# Altium schematic sheet 19_FPGA_misc.SchDoc: FPGA misc (PCIe, config)
size A3; Organization: Lime Microsystems; Address1: Surrey Tech Centre; Address2: Guildford GU2 7YG; Address3: Surrey; Address4: United Kingdom; Revision: v1.1; SheetNumber: 19; SheetTotal: 31
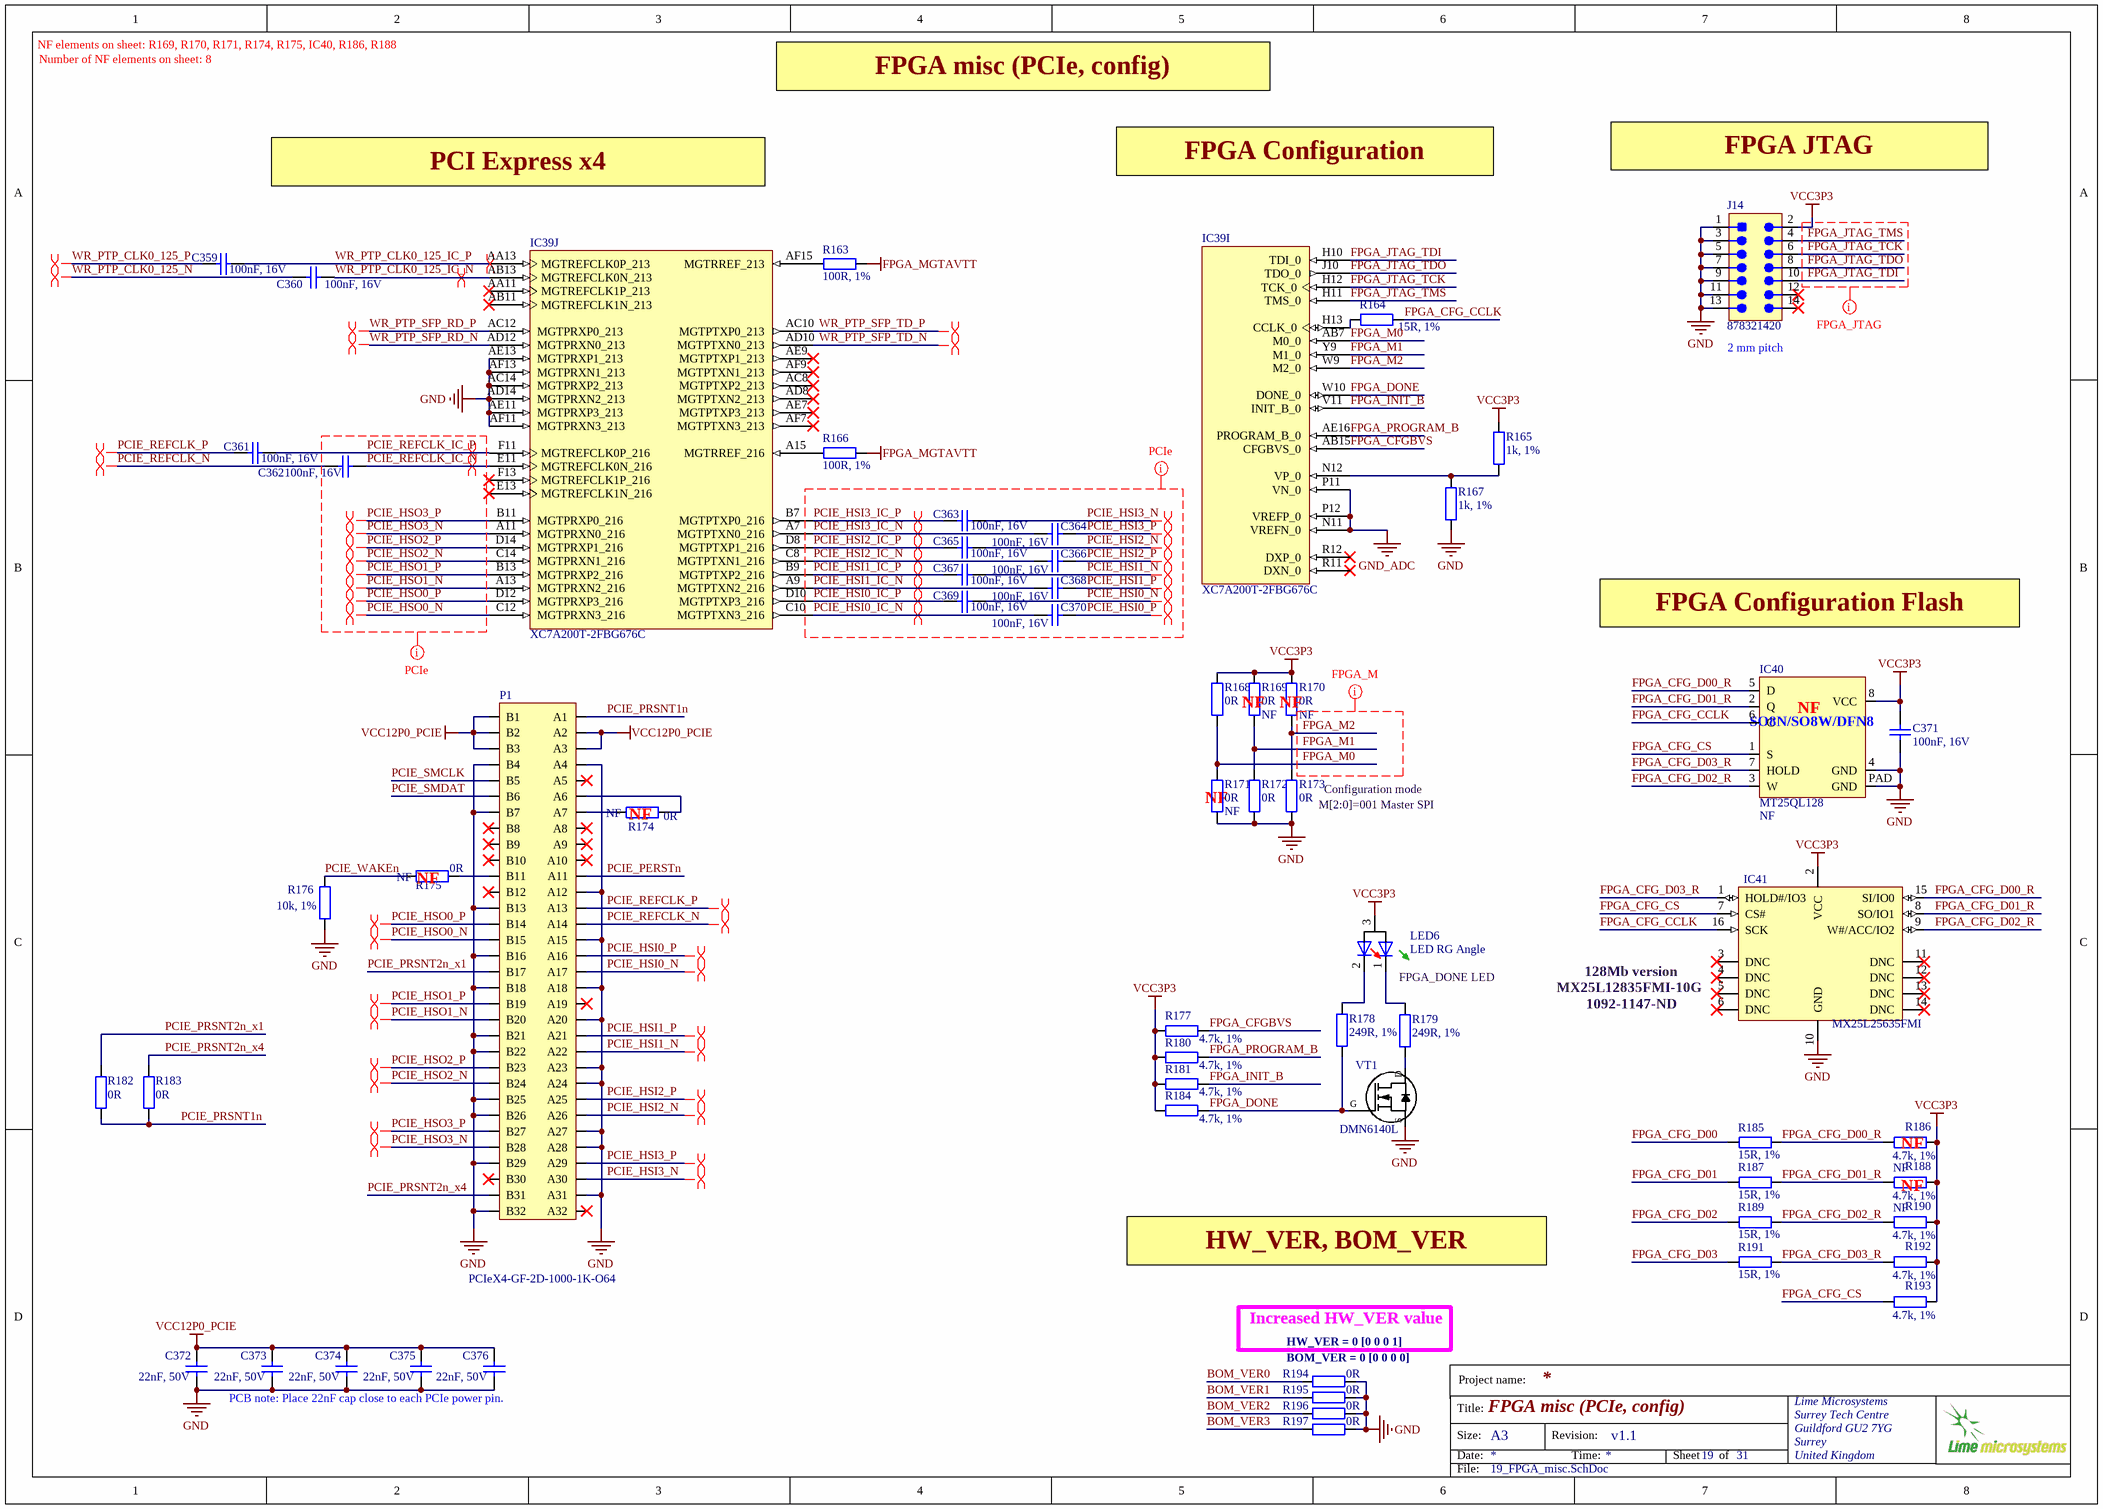
[diagram p0: 19_FPGA_misc.SchDoc]

## Parts
C359  100nF, 16V  [CAP0402]
C360  100nF, 16V  [CAP0402]
C361  100nF, 16V  [CAP0402]
C362  100nF, 16V  [CAP0402]
C363  100nF, 16V  [CAP0402]
C364  100nF, 16V  [CAP0402]
C365  100nF, 16V  [CAP0402]
C366  100nF, 16V  [CAP0402]
C367  100nF, 16V  [CAP0402]
C368  100nF, 16V  [CAP0402]
C369  100nF, 16V  [CAP0402]
C370  100nF, 16V  [CAP0402]
C371  100nF, 16V  [CAP0402]
C372  22nF, 50V  [CAP0402]
C373  22nF, 50V  [CAP0402]
C374  22nF, 50V  [CAP0402]
C375  22nF, 50V  [CAP0402]
C376  22nF, 50V  [CAP0402]
IC39  XC7A200T-2FBG676C  [XC7A200T-2FBG676C_FBG676]  (parts I,J of 14)
IC40  MT25QL128  Assembly Info: NF  [S25FL164K_WSON8_DFN6]
IC41  MX25L25635FMI  [SOIC16_WIDE]
J14  878321420  [MOLEX-878321420_V]
LED6  LED RG Angle  [LED_RG_RIGHT_ANGLE_v3]
P1  PCIeX4-GF-2D-1000-1K-O64  [PCIeX4-GF-2D-1000-1K-O64]  (no BOM)
R163  100R, 1%  [RES0402]
R164  15R, 1%  [RES0402]
R165  1k, 1%  [RES0402]
R166  100R, 1%  [RES0402]
R167  1k, 1%  [RES0402]
R168  0R  [RES0402]
R169  0R  Assembly Info: NF  [RES0402]
R170  0R  Assembly Info: NF  [RES0402]
R171  0R  Assembly Info: NF  [RES0402]
R172  0R  [RES0402]
R173  0R  [RES0402]
R174  0R  Assembly Info: NF  [RES0402]
R175  0R  Assembly Info: NF  [RES0402]
R176  10k, 1%  [RES0402]
R177  4.7k, 1%  [RES0402]
R178  249R, 1%  [RES0402]
R179  249R, 1%  [RES0402]
R180  4.7k, 1%  [RES0402]
R181  4.7k, 1%  [RES0402]
R182  0R  [RES0402]
R183  0R  [RES0402]
R184  4.7k, 1%  [RES0402]
R185  15R, 1%  [RES0402]
R186  4.7k, 1%  Assembly Info: NF  [RES0402]
R187  15R, 1%  [RES0402]
R188  4.7k, 1%  Assembly Info: NF  [RES0402]
R189  15R, 1%  [RES0402]
R190  4.7k, 1%  [RES0402]
R191  15R, 1%  [RES0402]
R192  4.7k, 1%  [RES0402]
R193  4.7k, 1%  [RES0402]
R194  0R  [RES0402]
R195  0R  [RES0402]
R196  0R  [RES0402]
R197  0R  [RES0402]
VT1  DMN6140L  [SOT23-3]

## Nets
FPGA_MGTAVTT: R163.2 R166.2
GND: C371.2 C372.2 C373.2 C374.2 C375.2 C376.2 IC39.AC14(MGTPRXP2_213) IC39.AD14(MGTPRXN2_213) IC39.AE11(MGTPRXP3_213) IC39.AE13(MGTPRXP1_213) IC39.AF11(MGTPRXN3_213) IC39.AF13(MGTPRXN1_213) IC40.4(GND) IC40.PAD(GND) IC41.10(GND) J14.1 J14.3 J14.5 J14.7 J14.9 J14.11 J14.13 P1.A4 P1.A12 P1.A15 P1.A18 P1.A20 P1.A23 P1.A24 P1.A27 P1.A28 P1.A31 P1.B4 P1.B7 P1.B13 P1.B16 P1.B18 P1.B21 P1.B22 P1.B25 P1.B26 P1.B29 P1.B32 R167.1 R171.2 R172.2 R173.2 R176.2 R194.2 R195.2 R196.2 R197.2 VT1.S
GND_ADC: IC39.N11(VREFN_0) IC39.P11(VN_0) IC39.P12(VREFP_0)
VCC3P3: C371.1 IC40.8(VCC) IC41.2(VCC) J14.2 LED6.3(A) R165.1 R168.1 R169.1 R170.1 R177.1 R180.1 R181.1 R184.1 R186.1 R188.1 R190.1 R192.1 R193.1
VCC12P0_PCIE: C372.1 C373.1 C374.1 C375.1 C376.1 P1.A2 P1.A3 P1.B1 P1.B2 P1.B3
BOM_VER0: R194.1
BOM_VER1: R195.1
BOM_VER2: R196.1
BOM_VER3: R197.1
FPGA_CFG_CCLK: IC40.6(C) IC41.16(SCK) R164.2
FPGA_CFG_CS: IC40.1(S) IC41.7(CS#) R193.2
FPGA_CFG_D00: R185.2
FPGA_CFG_D00_R: IC40.5(D) IC41.15(SI/IO0) R185.1 R186.2
FPGA_CFG_D01: R187.2
FPGA_CFG_D01_R: IC40.2(Q) IC41.8(SO/IO1) R187.1 R188.2
FPGA_CFG_D02: R189.2
FPGA_CFG_D02_R: IC40.3(W) IC41.9(W#/ACC/IO2) R189.1 R190.2
FPGA_CFG_D03: R191.2
FPGA_CFG_D03_R: IC40.7(HOLD) IC41.1(HOLD#/IO3) R191.1 R192.2
FPGA_CFGBVS: IC39.AB15(CFGBVS_0) R177.2
FPGA_DONE: IC39.W10(DONE_0) R178.1 R184.2 VT1.G
FPGA_INIT_B: IC39.V11(INIT_B_0) R181.2
FPGA_JTAG_TCK: IC39.H12(TCK_0) J14.6
FPGA_JTAG_TDI: IC39.H10(TDI_0) J14.10
FPGA_JTAG_TDO: IC39.J10(TDO_0) J14.8
FPGA_JTAG_TMS: IC39.H11(TMS_0) J14.4
FPGA_M0: IC39.AB7(M0_0) R168.2 R171.1
FPGA_M1: IC39.Y9(M1_0) R169.2 R172.1
FPGA_M2: IC39.W9(M2_0) R170.2 R173.1
FPGA_PROGRAM_B: IC39.AE16(PROGRAM_B_0) R180.2
PCIE_HSI0_IC_N: C370.2 IC39.C10(MGTPTXN3_216)
PCIE_HSI0_IC_P: C369.2 IC39.D10(MGTPTXP3_216)
PCIE_HSI0_N: C369.1 P1.A17
PCIE_HSI0_P: C370.1 P1.A16
PCIE_HSI1_IC_N: C368.2 IC39.A9(MGTPTXN2_216)
PCIE_HSI1_IC_P: C367.2 IC39.B9(MGTPTXP2_216)
PCIE_HSI1_N: C367.1 P1.A22
PCIE_HSI1_P: C368.1 P1.A21
PCIE_HSI2_IC_N: C366.2 IC39.C8(MGTPTXN1_216)
PCIE_HSI2_IC_P: C365.2 IC39.D8(MGTPTXP1_216)
PCIE_HSI2_N: C365.1 P1.A26
PCIE_HSI2_P: C366.1 P1.A25
PCIE_HSI3_IC_N: C364.2 IC39.A7(MGTPTXN0_216)
PCIE_HSI3_IC_P: C363.2 IC39.B7(MGTPTXP0_216)
PCIE_HSI3_N: C363.1 P1.A30
PCIE_HSI3_P: C364.1 P1.A29
PCIE_HSO0_N: IC39.C12(MGTPRXN3_216) P1.B15
PCIE_HSO0_P: IC39.D12(MGTPRXP3_216) P1.B14
PCIE_HSO1_N: IC39.A13(MGTPRXN2_216) P1.B20
PCIE_HSO1_P: IC39.B13(MGTPRXP2_216) P1.B19
PCIE_HSO2_N: IC39.C14(MGTPRXN1_216) P1.B24
PCIE_HSO2_P: IC39.D14(MGTPRXP1_216) P1.B23
PCIE_HSO3_N: IC39.A11(MGTPRXN0_216) P1.B28
PCIE_HSO3_P: IC39.B11(MGTPRXP0_216) P1.B27
PCIE_PERSTn: P1.A11
PCIE_PRSNT1n: P1.A1 R182.1 R183.1
PCIE_PRSNT2n_x1: P1.B17 R182.2
PCIE_PRSNT2n_x4: P1.B31 R183.2
PCIE_REFCLK_IC_N: C362.1 IC39.E11(MGTREFCLK0N_216)
PCIE_REFCLK_IC_P: C361.1 IC39.F11(MGTREFCLK0P_216)
PCIE_REFCLK_N: C362.2 P1.A14
PCIE_REFCLK_P: C361.2 P1.A13
PCIE_SMCLK: P1.B5
PCIE_SMDAT: P1.B6
PCIE_WAKEn: R175.1 R176.1
WR_PTP_CLK0_125_IC_N: C360.1 IC39.AB13(MGTREFCLK0N_213)
WR_PTP_CLK0_125_IC_P: C359.1 IC39.AA13(MGTREFCLK0P_213)
WR_PTP_CLK0_125_N: C360.2
WR_PTP_CLK0_125_P: C359.2
WR_PTP_SFP_RD_N: IC39.AD12(MGTPRXN0_213)
WR_PTP_SFP_RD_P: IC39.AC12(MGTPRXP0_213)
WR_PTP_SFP_TD_N: IC39.AD10(MGTPTXN0_213)
WR_PTP_SFP_TD_P: IC39.AC10(MGTPTXP0_213)
NetIC39_A15: IC39.A15(MGTRREF_216) R166.1
NetIC39_AF15: IC39.AF15(MGTRREF_213) R163.1
NetIC39_H13: IC39.H13(CCLK_0) R164.1
NetIC39_N12: IC39.N12(VP_0) R165.2 R167.2
NetLED6_1: LED6.1(C1) R179.2
NetLED6_2: LED6.2(C2) R178.2
NetP1_A6: P1.A6 R174.2
NetP1_A7: P1.A7 R174.1
NetP1_B11: P1.B11 R175.2
NetR179_1: R179.1 VT1.D

Not connected (* = marked no-connect by the designer): IC39 AA11(MGTREFCLK1P_213)* AB11(MGTREFCLK1N_213)* AC8(MGTPTXP2_213)* AD8(MGTPTXN2_213)* AE7(MGTPTXP3_213)* AE9(MGTPTXP1_213)* AF7(MGTPTXN3_213)* AF9(MGTPTXN1_213)* E13(MGTREFCLK1N_216)* F13(MGTREFCLK1P_216)* R11(DXN_0)* R12(DXP_0)*; IC41 3(DNC)* 4(DNC)* 5(DNC)* 6(DNC)* 11(DNC)* 12(DNC)* 13(DNC)* 14(DNC)*; J14 12* 14*; P1 A5* A8* A9* A10* A19* A32* B8* B9* B10* B12* B30*

## Layout directives
differential pair: PCIE_HSI0_IC_N, PCIE_HSI0_IC_P, PCIE_HSI0_N, PCIE_HSI0_P, PCIE_HSI1_IC_N, PCIE_HSI1_IC_P, PCIE_HSI1_N, PCIE_HSI1_P, PCIE_HSI2_IC_N, PCIE_HSI2_IC_P, PCIE_HSI2_N, PCIE_HSI2_P, PCIE_HSI3_IC_N, PCIE_HSI3_IC_P, PCIE_HSI3_N, PCIE_HSI3_P, PCIE_HSO0_N, PCIE_HSO0_P, PCIE_HSO1_N, PCIE_HSO1_P, PCIE_HSO2_N, PCIE_HSO2_P, PCIE_HSO3_N, PCIE_HSO3_P, PCIE_REFCLK_IC_N, PCIE_REFCLK_IC_P, PCIE_REFCLK_N, PCIE_REFCLK_P, WR_PTP_CLK0_125_IC_N, WR_PTP_CLK0_125_IC_P, WR_PTP_CLK0_125_N, WR_PTP_CLK0_125_P, WR_PTP_SFP_RD_N, WR_PTP_SFP_RD_P, WR_PTP_SFP_TD_N, WR_PTP_SFP_TD_P
net class FPGA_JTAG: FPGA_JTAG_TCK, FPGA_JTAG_TDI, FPGA_JTAG_TDO, FPGA_JTAG_TMS
net class FPGA_M: FPGA_M0, FPGA_M1, FPGA_M2
net class PCIe: PCIE_HSI0_IC_N, PCIE_HSI0_IC_P, PCIE_HSI0_N, PCIE_HSI0_P, PCIE_HSI1_IC_N, PCIE_HSI1_IC_P, PCIE_HSI1_N, PCIE_HSI1_P, PCIE_HSI2_IC_N, PCIE_HSI2_IC_P, PCIE_HSI2_N, PCIE_HSI2_P, PCIE_HSI3_IC_N, PCIE_HSI3_IC_P, PCIE_HSI3_N, PCIE_HSI3_P, PCIE_HSO0_N, PCIE_HSO0_P, PCIE_HSO1_N, PCIE_HSO1_P, PCIE_HSO2_N, PCIE_HSO2_P, PCIE_HSO3_N, PCIE_HSO3_P, PCIE_REFCLK_IC_N, PCIE_REFCLK_IC_P

## Notes on the sheet
- NF elements on sheet: R169, R170, R171, R174, R175, IC40, R186, R188
- Number of NF elements on sheet: 8
- FPGA misc (PCIe, config)
- PCI Express x4
- FPGA Configuration
- FPGA JTAG
- (near J14) 2 mm pitch
- FPGA Configuration Flash
- (near R169) NF
- (near R170) NF
- (near IC40) NF
- (near R174) NF
- (near R171) NF
- (near R173) M[2:0]=001 Master SPI
- (near R173) Configuration mode
- (near R175) NF
- FPGA_DONE LED
- (near IC41) 128Mb version
  MX25L12835FMI-10G
  1092-1147-ND
- (near R186) NF
- (near R188) NF
- HW_VER, BOM_VER
- Increased HW_VER value
- (near R194) BOM_VER = 0 [0 0 0 0]
- HW_VER = 0 [0 0 0 1]
- PCB note: Place 22nF cap close to each PCIe power pin.
- Project name:
- Title:
- Size:
- Date:
- A3
- Revision:
- Time:
- Sheet
- of
- File:
- (in symbol M25P40_with_pad) SO8N/SO8W/DFN8

## Library data of the parts
C359-C370 = Cap_0603: Part Description: 0.10µF ±10% 16V X7R Ceramic Capacitor -55°C ~ 125°C Surface Mount, MLCC 0402 (1005 Metric) 0.039" L x 0.020" W (1.00mm x 0.50mm); Manufacturer Part Number 1: GRM155R71C104KA88D; Brand: Murata Electronics; Tolerance: 10 %; Type: General Purpose MLCC; Capacitance: 0.1 uF; Temperature Coefficient / Code: +/- 15 %; Case Height: 0.5 mm; Case Length: 1 mm; Dielectric: X7R; Supplier 1: Mouser; Supplier Part Number 1: 81-GRM155R71C104KA88; Case Code - in: 0402; Manufacturer: Murata Electronics; Category: Multilayer Ceramic Capacitors MLCC - SMD/SMT; Voltage Rating DC: 16 V; Value: 100nF, 16V; Case Code - mm: 1005; Case Width: 0.5 mm; Maximum Operating Temperature: + 125 C; Minimum Operating Temperature: - 55 C; Minimum Order Quantity: 1; Operating Temperature Range: - 55 C to + 125 C; Package / Case: 0402 (1005 metric); Packaging: Reel; Product: General Type MLCCs; Product Category: Low & Medium Capacitance SMD Ceramic Chip Capacitors; Reeling: True; RoHS - Mouser: Y; RoHS: RoHS Compliant; Series: GRM; Standard Pack Qty: 10000; Termination Style: SMD/SMT
C371 = Cap_0603: Manufacturer Part Number 1: GRM155R71C104KA88D; Part Description: 0.10µF ±10% 16V X7R Ceramic Capacitor -55°C ~ 125°C Surface Mount, MLCC 0402 (1005 Metric) 0.039" L x 0.020" W (1.00mm x 0.50mm); Brand: Murata Electronics; Tolerance: 10 %; Type: General Purpose MLCC; Capacitance: 0.1 uF; Temperature Coefficient / Code: +/- 15 %; Case Height: 0.5 mm; Case Length: 1 mm; Dielectric: X7R; Supplier 1: Mouser; Supplier Part Number 1: 81-GRM155R71C104KA88; Case Code - in: 0402; Manufacturer: Murata Electronics; Category: Multilayer Ceramic Capacitors MLCC - SMD/SMT; Voltage Rating DC: 16 V; Value: 100nF, 16V; Case Code - mm: 1005; Case Width: 0.5 mm; Maximum Operating Temperature: + 125 C; Minimum Operating Temperature: - 55 C; Minimum Order Quantity: 1; Operating Temperature Range: - 55 C to + 125 C; Package / Case: 0402 (1005 metric); Packaging: Reel; Product: General Type MLCCs; Product Category: Low & Medium Capacitance SMD Ceramic Chip Capacitors; Reeling: True; RoHS - Mouser: Y; RoHS: RoHS Compliant; Series: GRM; Standard Pack Qty: 10000; Termination Style: SMD/SMT
C372-C376 = Cap_0402: Manufacturer: Kemet; Manufacturer Part Number 1: C0402C223K5RACTU; Part Description: 0.022µF ±10% 50V Ceramic Capacitor X7R 0402 (1005 Metric); Temperature Coefficient: X7R; Tolerance: ±10%; Capacitance: 0.022µF; Value: 22nF, 50V; Supplier 1: Digi-Key; Supplier Part Number 1: 399-7780-1-ND; Ratings: -; Packaging: Cut Tape (CT); Category: Capacitors; Size / Dimension: 0.039" L x 0.020" W (1.00mm x 0.50mm); RoHS: RoHS Compliant; Operating Temperature: -55°C ~ 125°C; Mounting Type: Surface Mount, MLCC; Applications: General Purpose; Voltage - Rated: 50V; Thickness (Max): 0.022" (0.55mm); Features: -; Height - Seated (Max): -; Lead Style: -; Package / Case: 0402 (1005 Metric); Lead Spacing: -
IC39 = XC7A200T-2FBG676C: Artix-7 FPGA, 400 User I/Os, 8 GTP, 676-Ball BGA, Speed Grade 2, Commercial Grade, Pb-Free; Manufacturer: Xilinx; Part Description: IC FPGA 400 I/O 676FCBGA; Speed Grade: -2; Number of Logic Blocks (LABs): 16825; Number of Logic Elements/Cells: 215360; RAM Size: 13455360b; Number of I/Os: 400; Number of Registers: 269200; Memory Type: DDR3; Memory Size: 1GB; Max Supply Voltage: 1.05V; Min Supply Voltage: 950mV; ComponentLink1Description: Manufacturer URL; ComponentLink1URL: http://www.xilinx.com/; ComponentLink2Description: Datasheet; ComponentLink2URL: http://www.xilinx.com/support/documentation/data_sheets/ds180_7Series_Overview.pdf; ComponentLink3Description: Package Specification; ComponentLink3URL: http://www.xilinx.com/support/documentation/user_guides/ug475_7Series_Pkg_Pinout.pdf; ComponentLink4Description: DC and Switching Characteristics; ComponentLink4URL: http://www.xilinx.com/support/documentation/data_sheets/ds181_Artix_7_Data_Sheet.pdf; ComponentLink5Description: Package File; ComponentLink5URL: http://www.xilinx.com/support/packagefiles/a7packages/xc7a200tfbg676pkg.txt; ComponentLink6Description: Packaging and Pinout; ComponentLink6URL: http://www.xilinx.com/support/documentation/user_guides/ug475_7Series_Pkg_Pinout.pdf; Supplier 1: Digi-Key; Supplier Part Number 1: 122-1865-ND; Manufacturer Part Number 1: XC7A200T-2FBG676C; Stock 1: 124; Pricing 1: 1=261,30000 (USD); RoHS: Yes; Case/Package: FCBGA; Number of Pins: 676; Contact Plating: Copper,Tin,Silver; Min Operating Temperature: 0°C; Max Operating Temperature: 85°C; ComponentLink7URL: https://datasheet.ciiva.com/15066/ds181-artix-7-data-sheet-15066344.pdf?src-supplier=Digi-Key; ComponentLink7Description: https://datasheet.ciiva.com/15066/ds181-artix-7-data-sheet-15066344.pdf?src-supplier=Digi-Key; ComponentLink8URL: https://datasheet.ciiva.com/48475/ds180-7series-overview-48475947.pdf?src-supplier=Avnet; ComponentLink8Description: https://datasheet.ciiva.com/48475/ds180-7series-overview-48475947.pdf?src-supplier=Avnet
IC40 = M25P40_with_pad: Manufacturer: Micron Technology; Manufacturer Part Number 1: MT25QL128ABA1ESE-0SITTR; Part Description: FLASH - NOR Memory IC 128Mb (16M x 8) SPI 133MHz  8-SO; Frequency: 133MHz; Memory Size: 128Mb; Memory Type: Non-Volatile,FLASH; Case/Package: SOIC; Max Operating Temperature: 85°C; Min Operating Temperature: -40°C; Mount: Surface Mount; Number of Pins: 8; Packaging: Tape and Reel; Pricing 1: 1=2.67, 10=2.401, 25=2.3632, 50=2.357, 100=2.1061, 250=2.03764, 500=2.03006 (USD); Stock 1: 4313; Supplier 1: Digi-Key; Supplier Part Number 1: 557-1772-1-ND; Value: MT25QL128
IC41 = S25FL032P: Manufacturer: Macronix; Manufacturer Part Number 1: MX25L25635FMI-10G; Part Description: FLASH - NOR Memory IC 256Mb (32M x 8) SPI 104MHz  16-SOP; Operating Supply Voltage: 3.6V; Interface: SPI,Serial; Memory Type: FLASH,NOR; Frequency: 104MHz; Density: 256Mb; Supplier 1: Digi-Key; Supplier Part Number 1: 1092-1149-ND; Stock 1: 19945; Pricing 1: 1=4.09, 528=3.11068 (USD); Case/Package: SOIC; Number of Pins: 16; Min Operating Temperature: -40°C; Max Operating Temperature: 85°C; Package Quantity: 44; Packaging: Rail/Tube; Max Frequency: 104MHz; Lead Free: Lead Free; Value: MX25L25635FMI
J14 = MOLEX_CONNECTOR_0878321420: Male Header, Pitch 2 mm, 2 x 7 Position, Height 7.6 mm, -55 to 105 degC, RoHS; Part Description: Connector Header Surface Mount 14 position 0.079" (2.00mm); Manufacturer: Molex; Manufacturer Part Number 1: 87832-1420; Number of Positions: 14; Current Rating: 2A; Insulation Resistance: 1GR; Voltage Rating: 125V; Shrouded: Yes (With); Pitch: 2mm; Glow Wire Compliant: Non-compliant; Supplier 1: Digi-Key; Stock 1: 62479; Pricing 1: 1 = 1,83000, 10 = 1,66000, 100 = 1,42280, 500 = 1,18562, 3200 = 0,94850, 6400 = 0,90108 (USD); RoHS: Yes; Mount: Surface Mount; Color: Black; Housing Color: Black; Housing Material: Thermoplastic; Contact Plating: Gold; Contact Material: Brass; Min Operating Temperature: -55°C; Max Operating Temperature: 105°C; Number of Rows: 2; Packaging: Rail/Tube; Termination: SMD/SMT; Number of Contacts: 14; Orientation: Vertical; Gender: Male; Package Quantity: 3200; Number of Circuits: 14; Voltage Rating (DC): 125V; Radiation Hardening: No; REACH SVHC: No SVHC; Lead Free: Lead Free; Flammability Rating: UL94 V-0; ComponentLink1URL: https://datasheet.ciiva.com/5151/0878321420-pcb-headers-176595-5151942.pdf?src-supplier=Mouser; ComponentLink1Description: https://datasheet.ciiva.com/5151/0878321420-pcb-headers-176595-5151942.pdf?src-supplier=Mouser; ComponentLink2URL: https://datasheet.ciiva.com/30118/0878321420-pcb-headers-30118102.pdf?src-supplier=Onlinecomponents.com; ComponentLink2Description: https://datasheet.ciiva.com/30118/0878321420-pcb-headers-30118102.pdf?src-supplier=Onlinecomponents.com; ComponentLink3URL: https://datasheet.ciiva.com/11746/0900766b80d68d6a-11746394.pdf?src-supplier=RSComponents; ComponentLink3Description: https://datasheet.ciiva.com/11746/0900766b80d68d6a-11746394.pdf?src-supplier=RSComponents; ComponentLink4URL: https://datasheet.ciiva.com/7814/1625645-7814923.pdf?src-supplier=Element14; ComponentLink4Description: https://datasheet.ciiva.com/7814/1625645-7814923.pdf?src-supplier=Element14; ComponentLink5URL: https://datasheet.ciiva.com/27055/1934622-27055085.pdf?src-supplier=Jameco; ComponentLink5Description: https://datasheet.ciiva.com/27055/1934622-27055085.pdf?src-supplier=Jameco; ComponentLink6URL: https://datasheet.ciiva.com/1103/1739253-1103569.pdf?src-supplier=Element14; ComponentLink6Description: https://datasheet.ciiva.com/1103/1739253-1103569.pdf?src-supplier=Element14; ComponentLink7URL: https://datasheet.ciiva.com/18453/70090647-18453733.pdf?src-supplier=Allied+Electronics; ComponentLink7Description: https://datasheet.ciiva.com/18453/70090647-18453733.pdf?src-supplier=Allied+Electronics; ComponentLink8URL: https://datasheet.ciiva.com/6168/1597333-6168907.pdf?src-supplier=Farnell; ComponentLink8Description: https://datasheet.ciiva.com/6168/1597333-6168907.pdf?src-supplier=Farnell; Supplier Part Number 1: WM18641-ND
LED6 = LED_green_red_right_angle_v2: Part Description: Green, Red 572nm Green, 647nm Red LED Indication - Discrete 2.1V Green, 1.7V Red 2-SMD, No Lead; Manufacturer: Stanley Electric; Manufacturer Part Number 1: BRPY1211FTR; Color: Green,Red; Lens Color: White; Viewing Angle: 143°; Forward Voltage: 1.7V; Lens Style: Colorless; Wavelength: 570nm; Reverse Breakdown Voltage: 4V; Forward Current: 25mA; Dominant Wavelength: 647nm; Luminous Intensity: 17.6mcd; Test Current: 20mA; Lens Transparency: Diffused; Number of Elements: 2; Power Dissipation: 70mW; Supplier 1: Arrow Electronics; Supplier Part Number 1: BRPY1211F-TR; Stock 1: 0; RoHS: Yes; Mount: Surface Mount; Case/Package: SMD/SMT; Number of Pins: 3; Min Operating Temperature: -40°C; Max Operating Temperature: 85°C; Packaging: Tape and Reel; Package Quantity: 3000; Reverse Voltage: 4V; Length: 3mm; Width: 2mm; Height: 1.15mm; Depth: 2mm; Radiation Hardening: No; Lead Free: Lead Free; ComponentLink1URL: https://datasheet.ciiva.com/2114/1211f-e-2114386.pdf?src-supplier=Digi-Key; ComponentLink1Description: https://datasheet.ciiva.com/2114/1211f-e-2114386.pdf?src-supplier=Digi-Key
R163 R166 = Res_0402: Manufacturer Part Number 1: RMCF0402FT100R; Part Description: RES SMD 100 OHM 1% 1/16W 0402; Manufacturer: Stackpole Electronics Inc.; Temperature Coefficient: ±100ppm/°C; Supplier 1: Digi-Key; Supplier Part Number 1: RMCF0402FT100RDKR-ND; Package / Case: 0402 (1005 Metric); Composition: Thick Film; Category: Resistors; Tolerance: ±1%; Value: 100R, 1%
R164 = Res_0402: Manufacturer: Yageo; Manufacturer Part Number 1: RC0402FR-0715RL; Part Description: 15 Ohms ±1% 0.063W, 1/16W Chip Resistor 0402 (1005 Metric) Moisture Resistant Thick Film; Max Power Dissipation: 63mW; Temperature Coefficient: 100ppm/°C; Voltage Rating: 50V; ComponentLink1URL: http://www.farnell.com/datasheets/1018594.pdf?src-supplier=Element14; ComponentLink1Description: http://www.farnell.com/datasheets/1018594.pdf?src-supplier=Element14; ComponentLink2URL: https://www.verical.com/server-webapp/html/getDatasheet?partID=323697&src-supplier=Verical; ComponentLink2Description: https://www.verical.com/server-webapp/html/getDatasheet?partID=323697&src-supplier=Verical; Value: 15R, 1%; Case/Package: 0402; Case Code (Imperial): 0402; Case Code (Metric): 1005; ComponentLink3Description: http://www.yageo.com/documents/recent/PYu-RC0402_51_RoHS_L_6_r.pdf?src-supplier=Future+Electronics; ComponentLink3URL: http://www.yageo.com/documents/recent/PYu-RC0402_51_RoHS_L_6_r.pdf?src-supplier=Future+Electronics; ComponentLink4Description: http://www.yageo.com/documents/recent/PYu-RC0402_51_RoHS_L_6_r.pdf?src-supplier=Mouser; ComponentLink4URL: http://www.yageo.com/documents/recent/PYu-RC0402_51_RoHS_L_6_r.pdf?src-supplier=Mouser; Composition: Thick Film; Depth: 0.5mm; Features: Moisture Resistant; Height: 0.016inch; Lead Free: Lead Free; Length: 1mm; Max Operating Temperature: 155°C; Military Standard: Not; Min Operating Temperature: -55°C; Number of Terminations: 2; Package Quantity: 1; Packaging: Tape and Reel; Power Rating: 63mW; Pricing 1: 1=0.1, 10=0.016, 100=0.0067, 1000=0.00301, 2500=0.00261, 5000=0.00215 (USD); REACH SVHC: Unknown; Resistance: 15R; Stock 1: 1902799; Supplier 1: Digi-Key; Supplier Part Number 1: 311-15LRCT-ND; Termination: SMD/SMT; Tolerance: 1%; Width: 0.02inch
R165 R167 = Res_0402: Manufacturer: Stackpole Electronics Inc; Manufacturer Part Number 1: RMCF0402FT1K00; Part Description: RES SMD 1K OHM 1% 1/16W 0402; Temperature Coefficient: ±100ppm/°C; Power (Watts): 0.063W, 1/16W; Value: 1k, 1%; Supplier 1: Digi-Key; Supplier Part Number 1: RMCF0402FT1K00TR-ND; Resistance (Ohms): 1k; Packaging: Tape & Reel (TR); Category: Resistors; RoHS: RoHS Compliant; Tolerance: ±1%; Height: 0.016" (0.40mm); Number of Terminations: 2; Package / Case: 0402 (1005 Metric); Operating Temperature: -55°C ~ 155°C; Features: -; Composition: Thick Film; Supplier Device Package: 0402; Size / Dimension: 0.039" L x 0.020" W (1.00mm x 0.50mm)
R168-R173 = Res_0402: Manufacturer Part Number 1: RC0402JR-070RL; Manufacturer: Yageo; Part Description: RES SMD 0.0OHM JUMPER 1/16W 0402; Resistance (Ohms): 0.0; Tolerance: Jumper; Power (Watts): 0.063W, 1/16W; Value: 0R; Supplier 1: Digi-Key; Supplier Part Number 1: 311-0.0JRTR-ND; Category: Resistors; Temperature Coefficient: -; Features: Moisture Resistant; Supplier Device Package: 0402; Height: 0.016" (0.40mm); Package / Case: 0402 (1005 Metric); Operating Temperature: -55°C ~ 155°C; Size / Dimension: 0.039" L x 0.020" W (1.00mm x 0.50mm); Composition: Thick Film; Packaging: Tape & Reel (TR); Number of Terminations: 2; RoHS: RoHS Compliant
R174 R175 R182 R183 R194-R197 = Res_0402: Manufacturer: Yageo; Part Description: RES SMD 0.0OHM JUMPER 1/16W 0402; Manufacturer Part Number 1: RC0402JR-070RL; Supplier 1: Digi-Key; Supplier Part Number 1: 311-0.0JRTR-ND; Composition: Thick Film; Package / Case: 0402 (1005 Metric); Category: Resistors; Value: 0R
R176 = Res_0402: Manufacturer: Yageo; Manufacturer Part Number 1: RC0402FR-0710KL; Part Description: RES SMD 10K OHM 1% 1/16W 0402; Temperature Coefficient: ±100ppm/°C; Power (Watts): 0.063W, 1/16W; Value: 10k, 1%; Supplier 1: Digi-Key; Supplier Part Number 1: 311-10.0KLRTR-ND; Resistance (Ohms): 10k; Packaging: Tape & Reel (TR); RoHS: RoHS Compliant; Package / Case: 0402 (1005 Metric); Tolerance: ±1%; Operating Temperature: -55°C ~ 155°C; Size / Dimension: 0.039" L x 0.020" W (1.00mm x 0.50mm); Number of Terminations: 2; Category: Resistors; Height: 0.016" (0.40mm); Supplier Device Package: 0402; Features: Moisture Resistant; Composition: Thick Film
R177 R180 R181 R184 R186 R188 R190 R192 R193 = Res_0402: Manufacturer: Yageo; Part Description: RES SMD 4.7K OHM 1% 1/16W 0402; Manufacturer Part Number 1: RC0402FR-074K7L; Temperature Coefficient: ±100ppm/°C; Power (Watts): 0.063W, 1/16W; Number of Terminations: 2; Category: Resistors; Supplier 1: Digi-Key; Height: 0.016" (0.40mm); Features: Moisture Resistant; Size / Dimension: 0.039" L x 0.020" W (1.00mm x 0.50mm); Supplier Device Package: 0402; RoHS: RoHS Compliant; Composition: Thick Film; Package / Case: 0402 (1005 Metric); Resistance (Ohms): 4.7k; Operating Temperature: -55°C ~ 155°C; Tolerance: ±1%; Supplier Part Number 1: 311-4.7KLRCT-ND; Packaging: Cut Tape (CT); Value: 4.7k, 1%
R178 R179 = Res_0402: Manufacturer Part Number 1: RMCF0402FT249R; Manufacturer: Stackpole Electronics Inc; Part Description: RES SMD 249 OHM 1% 1/16W 0402; Resistance (Ohms): 249; Power (Watts): 0.063W, 1/16W; Temperature Coefficient: ±100ppm/°C; Value: 249R, 1%; Supplier 1: Digi-Key; Supplier Part Number 1: RMCF0402FT249RCT-ND; Package / Case: 0402 (1005 Metric); Features: -; Size / Dimension: 0.039" L x 0.020" W (1.00mm x 0.50mm); Category: Resistors; Operating Temperature: -55°C ~ 155°C; Packaging: Cut Tape (CT); Tolerance: ±1%; Supplier Device Package: 0402; RoHS: RoHS Compliant; Composition: Thick Film; Number of Terminations: 2; Height: 0.016" (0.40mm)
R185 R187 R189 R191 = Res_0402: Manufacturer: Yageo; Manufacturer Part Number 1: RC0402FR-0715RL; Part Description: 15 Ohms ±1% 0.063W, 1/16W Chip Resistor 0402 (1005 Metric) Moisture Resistant Thick Film; Power Rating: 63mW; Voltage Rating: 50V; Temperature Coefficient: 100ppm/°C; Value: 15R, 1%; Supplier 1: Digi-Key; Supplier Part Number 1: 311-15LRCT-ND; Stock 1: 1902799; Pricing 1: 1=0.1, 10=0.016, 100=0.0067, 1000=0.00301, 2500=0.00261, 5000=0.00215 (USD); Case/Package: 0402; Case Code (Metric): 1005; Case Code (Imperial): 0402; Min Operating Temperature: -55°C; Max Operating Temperature: 155°C; Resistance: 15R; Tolerance: 1%; Packaging: Tape and Reel; Package Quantity: 1; Composition: Thick Film; Number of Terminations: 2; Termination: SMD/SMT; Military Standard: Not; Max Power Dissipation: 63mW; Features: Moisture Resistant; Length: 1mm; Height: 0.016inch; Width: 0.02inch; Depth: 0.5mm; REACH SVHC: Unknown; Lead Free: Lead Free; ComponentLink1URL: http://www.yageo.com/documents/recent/PYu-RC_Group_51_RoHS_L_9.pdf?src-supplier=Digi-Key; ComponentLink1Description: http://www.yageo.com/documents/recent/PYu-RC_Group_51_RoHS_L_9.pdf?src-supplier=Digi-Key; ComponentLink2URL: http://www.yageo.com/documents/recent/PYu-RC_Group_51_RoHS_L_10.pdf?src-supplier=Digi-Key; ComponentLink2Description: http://www.yageo.com/documents/recent/PYu-RC_Group_51_RoHS_L_10.pdf?src-supplier=Digi-Key; ComponentLink3URL: http://www.yageo.com/documents/recent/PYu-RC0402_51_RoHS_L_6_r.pdf?src-supplier=Future+Electronics; ComponentLink3Description: http://www.yageo.com/documents/recent/PYu-RC0402_51_RoHS_L_6_r.pdf?src-supplier=Future+Electronics; ComponentLink4URL: http://www.yageo.com/documents/recent/PYu-RC0402_51_RoHS_L_6_r.pdf?src-supplier=Mouser; ComponentLink4Description: http://www.yageo.com/documents/recent/PYu-RC0402_51_RoHS_L_6_r.pdf?src-supplier=Mouser
VT1 = NDS331N: Manufacturer Part Number: DMN6140L-13; Manufacturer: Diodes Incorporated; Part Description: N-Channel 60V 1.6A (Ta) 700mW (Ta) Surface Mount SOT-23; Power Dissipation (Max): 700mW (Ta); Vgs (Max): ±20V; Current - Continuous Drain (Id) @ 25°C: 1.6A (Ta); FET Type: N-Channel; Rds On (Max) @ Id, Vgs: 140 mOhm @ 1.8A, 10V; Vgs(th) (Max) @ Id: 3V @ 250µA; Drive Voltage (Max Rds On,  Min Rds On): 4.5V, 10V; FET Feature: -; Supplier Device Package: SOT-23; Supplier Part Number 1: DMN6140L-13DICT-ND; RoHS: RoHS Compliant; Technology: MOSFET (Metal Oxide); Package / Case: TO-236-3, SC-59, SOT-23-3; Mounting Type: Surface Mount; Packaging: Cut Tape (CT); Category: Discrete Semiconductor Products; Supplier 1: Digi-Key; Operating Temperature: -55°C ~ 150°C (TJ); Part Status: Active; Value: DMN6140L; Manufacturer Part Number 1: DMN6140L-13